# Altium schematic sheet BDAN_ACOND.SchDoc
size A4; SheetNumber: 3; SheetTotal: 5
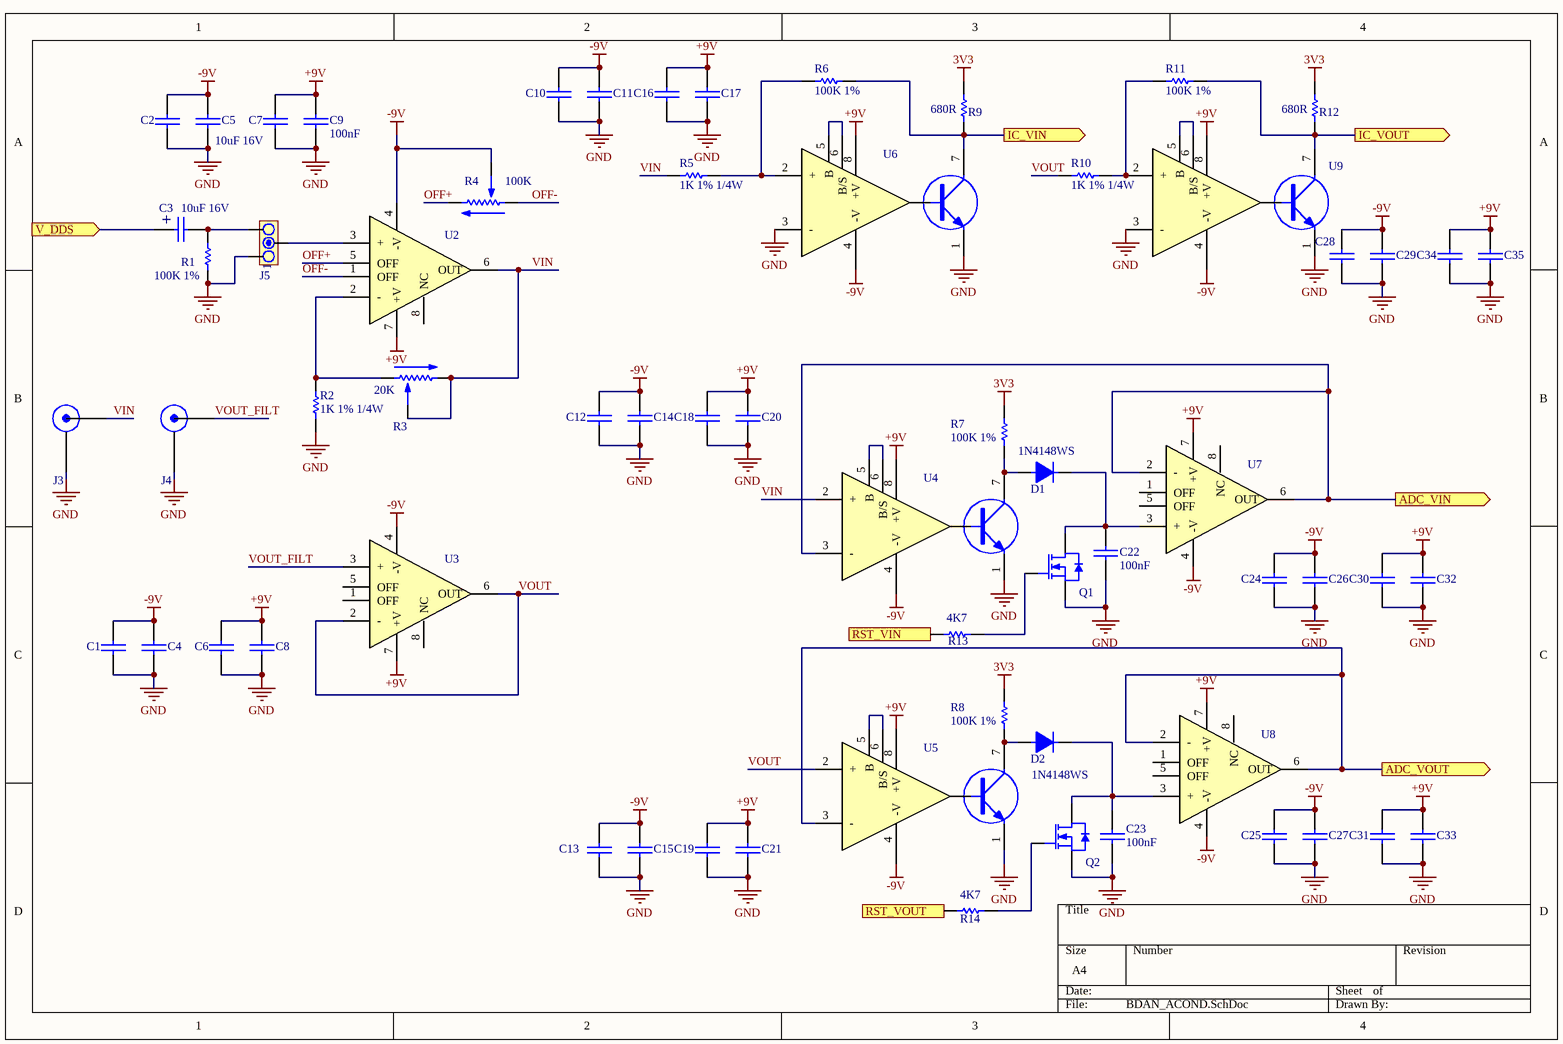
[diagram p0: BDAN_ACOND.SchDoc]

## Parts
C1  100nF  [0805]  (value not drawn)
C2  100nF  [0805]  (value not drawn)
C3  10uF 16V  [CAP318]
C4  10uF 16V  [0805]  (value not drawn)
C5  10uF 16V  [0805]  (value not drawn)
C6  10uF 16V  [0805]  (value not drawn)
C7  10uF 16V  [0805]
C8  100nF  [0805]  (value not drawn)
C9  100nF  [0805]
C10  100nF  [0805]  (value not drawn)
C11  10uF 16V  [0805]  (value not drawn)
C12  100nF  [0805]  (value not drawn)
C13  100nF  [0805]  (value not drawn)
C14  10uF 16V  [0805]  (value not drawn)
C15  10uF 16V  [0805]  (value not drawn)
C16  10uF 16V  [0805]  (value not drawn)
C17  100nF  [0805]  (value not drawn)
C18  10uF 16V  [0805]  (value not drawn)
C19  10uF 16V  [0805]  (value not drawn)
C20  100nF  [0805]  (value not drawn)
C21  100nF  [0805]  (value not drawn)
C22  100nF  [CAP508]
C23  100nF  [CAP508]
C24  100nF  [0805]  (value not drawn)
C25  100nF  [0805]  (value not drawn)
C26  10uF 16V  [0805]  (value not drawn)
C27  10uF 16V  [0805]  (value not drawn)
C28  100nF  [0805]  (value not drawn)
C29  10uF 16V  [0805]  (value not drawn)
C30  10uF 16V  [0805]  (value not drawn)
C31  10uF 16V  [0805]  (value not drawn)
C32  100nF  [0805]  (value not drawn)
C33  100nF  [0805]  (value not drawn)
C34  10uF 16V  [0805]  (value not drawn)
C35  100nF  [0805]  (value not drawn)
D1  1N4148WS  [SOD323F]
D2  1N4148WS  [SOD323F]
J3  BNC  [BNC]  (value not drawn)
J4  BNC  [BNC]  (value not drawn)
J5  JUMPER3  [JUMPER3]  (value not drawn)
Q1  2N7000  [TO92_DGS]  (value not drawn)
Q2  2N7000  [TO92_DGS]  (value not drawn)
R1  100K 1%  [0805]
R2  1K 1% 1/4W  [0805]
R3  20K  [3296W-TOP]
R4  100K  [3296W-TOP]
R5  1K 1% 1/4W  [0805]
R6  100K 1%  [0805]
R7  100K 1%  [0805]
R8  100K 1%  [0805]
R9  680R  [0805]
R10  1K 1% 1/4W  [0805]
R11  100K 1%  [0805]
R12  680R  [0805]
R13  4K7  [0805]
R14  4K7  [0805]
U2  OPA604APG4  [DIP8]  (value not drawn)
U3  OPA604APG4  [DIP8]  (value not drawn)
U4  LM311M  [DIP8]  (value not drawn)
U5  LM311M  [DIP8]  (value not drawn)
U6  LM311M  [DIP8]  (value not drawn)
U7  OPA604APG4  [DIP8]  (value not drawn)
U8  OPA604APG4  [DIP8]  (value not drawn)
U9  LM311M  [DIP8]  (value not drawn)

## Ports
ADC_VIN (out), ADC_VOUT (out), IC_VIN (out), IC_VOUT (out), RST_VIN (in), RST_VOUT (in), V_DDS (in)

## Nets
3V3: R7.2 R8.2 R9.2 R12.2
+9V: C6.1 C7.1 C8.1 C9.1 C16.1 C17.1 C18.1 C19.1 C20.1 C21.1 C30.1 C31.1 C32.1 C33.1 C34.1 C35.1 U2.7(+V) U3.7(+V) U4.8(+V) U5.8(+V) U6.8(+V) U7.7(+V) U8.7(+V) U9.8(+V)
-9V: C1.1 C2.1 C4.1 C5.1 C10.1 C11.1 C12.1 C13.1 C14.1 C15.1 C24.1 C25.1 C26.1 C27.1 C28.1 C29.1 R4.2(WIPER) U2.4(-V) U3.4(-V) U4.4(-V) U5.4(-V) U6.4(-V) U7.4(-V) U8.4(-V) U9.4(-V)
GND: C1.2 C2.2 C4.2 C5.2 C6.2 C7.2 C8.2 C9.2 C10.2 C11.2 C12.2 C13.2 C14.2 C15.2 C16.2 C17.2 C18.2 C19.2 C20.2 C21.2 C22.2 C23.2 C24.2 C25.2 C26.2 C27.2 C28.2 C29.2 C30.2 C31.2 C32.2 C33.2 C34.2 C35.2 J3.1 J4.1 J5.1 Q1.3(S) Q2.3(S) R1.1 R2.1 U4.1(EMIT_OUT) U5.1(EMIT_OUT) U6.1(EMIT_OUT) U6.3(-) U9.1(EMIT_OUT) U9.3(-)
ADC_VIN: U4.3(-) U7.2(-) U7.6(OUT) ; port ADC_VIN
ADC_VOUT: U5.3(-) U8.2(-) U8.6(OUT) ; port ADC_VOUT
IC_VIN: R6.1 R9.1 U6.7(COL_OUT) ; port IC_VIN
IC_VOUT: R11.1 R12.1 U9.7(COL_OUT) ; port IC_VOUT
OFF+: R4.3(CW) U2.5(OFF)
OFF-: R4.1(CCW) U2.1(OFF)
RST_VIN: R13.1 ; port RST_VIN
RST_VOUT: R14.1 ; port RST_VOUT
V_DDS: C3.1 ; port V_DDS
VIN: J3.2 R3.2(WIPER) R3.3(CW) R5.2 U2.6(OUT) U4.2(+)
VOUT: R10.2 U3.2(-) U3.6(OUT) U5.2(+)
VOUT_FILT: J4.2 U3.3(+)
NetC3_2: C3.2 J5.3 R1.2
NetC22_1: C22.1 D1.2 Q1.2(D) U7.3(+)
NetC23_1: C23.1 D2.2 Q2.2(D) U8.3(+)
NetD1_1: D1.1 R7.1 U4.7(COL_OUT)
NetD2_1: D2.1 R8.1 U5.7(COL_OUT)
NetJ5_2: J5.2 U2.3(+)
NetQ1_1: Q1.1(G) R13.2
NetQ2_1: Q2.1(G) R14.2
NetR2_2: R2.2 R3.1(CCW) U2.2(-)
NetR5_1: R5.1 R6.2 U6.2(+)
NetR10_1: R10.1 R11.2 U9.2(+)
NetU4_5: U4.5(B) U4.6(B/S)
NetU5_5: U5.5(B) U5.6(B/S)
NetU6_5: U6.5(B) U6.6(B/S)
NetU9_5: U9.5(B) U9.6(B/S)

Not connected (* = marked no-connect by the designer): U2 8(NC); U3 1(OFF) 5(OFF) 8(NC); U7 1(OFF) 5(OFF) 8(NC); U8 1(OFF) 5(OFF) 8(NC)

## Notes on the sheet
- (in symbol CAP_TAN_10uF_16V_CAP318) +

## Library data of the parts
C1 C2 C8-C10 C12 C13 C17 C20 C21 C24 C25 C28 C32 C33 C35 = CAP0805_100nF_X7R: CAP0805 100nF X7R; CREO: CP; Part Number: CAP0805_100nF_X7R; Value: 100nF
C3 = CAP_TAN_10uF_16V_CAP318: CAP TANT 10UF 10% 16V RADIAL; Manufacturer: KYOCERA AVX; Manufacturer Part Number: TAP106K016CRS; CREO: JP; Part Number: CAP_TAN_10uF_16V_CAP318; Value: 10uF 16V; Supplier 1: Digi-Key; Supplier Part Number 1: 478-TAP106K016CRSCT-ND; APROBO: -
C4-C7 C11 C14-C16 C18 C19 C26 C27 C29-C31 C34 = CAP0805_10uF_16V_X5R: CAP0805 10uF 16V X5R; Manufacturer: TDK Corporation; Manufacturer Part Number: C2012X5R1C106K085AC; CREO: AP; Part Number: CAP0805_10uF_16V_X5R; Value: 10uF 16V; Supplier 1: Digi-Key; Supplier Part Number 1: 445-7644-1-ND
C22 C23 = CAP_CER_100nF_250V_CAP508: CAP CER RAD 100NF 250V C0G 10%; CREO: JP; Part Number: CAP_CER_100nF_250V_CAP508; Value: 100nF; Supplier 1: Digi-Key; APROBO: -
D1 D2 = 1N4148_SOD323F: DIODE 75V 150MA SOD323F; CREO: EB; Part Number: 1N4148_SOD323F; Value: 1N4148WS; Supplier 1: Digi-Key; Supplier Part Number 1: 1N4148WSFSTR-ND
J3 J4 = BNC: CONN BNC RCPT STR 50 OHM PCB; Manufacturer: Amphenol RF; Manufacturer Part Number: 112404; Publico: JP; Part Number: BNC; Value: BNC; Supplier 1: Digi-Key; Supplier Part Number 1: ACX1051-ND
J5 = JUMPER3_TH: TIRA DE PINES 1x3 0.1" + JUMPER; Manufacturer: Harwin Inc.; Manufacturer Part Number: M20-9990345; Publico: EB; Part Number: JUMPER3_TH; Value: JUMPER3; Supplier 1: Digi-Key; Supplier Part Number 1: 952-2263-ND; Aprobo: -
Q1 Q2 = 2N7000_TO92: MOSFET N-CH 60V 200MA TO-92; Publico: EB; Part Number: 2N7000_TO92; Value: 2N7000; Aprobo: -
R1 R6-R8 R11 = RES0805_100K_1%: RES0805 100K 1%; Manufacturer: Stackpole Electronics Inc; Manufacturer Part Number: RMCF0805FG100K; Publico: EB; Part Number: RES0805_100K_1%; Value: 100K 1%; Supplier 1: Digi-Key; Supplier Part Number 1: RMCF0805FG100KCT-ND; Aprobo: -
R2 R5 R10 = RES0805_1K_1%: RES SMD 1K OHM 1% 1/4W 0805; Manufacturer: Stackpole Electronics Inc; Manufacturer Part Number: RNCP0805FTD1K00; Publico: JS; Part Number: RES0805_1K_1%; Value: 1K 1% 1/4W; Supplier 1: Digi-Key; Supplier Part Number 1: RNCP0805FTD1K00TR-ND; Aprobo: -
R3 = TRIMMER_3296W_20K: 3296 TRIMMER 20K OHM 0.5W PC PIN; Manufacturer: Bourns Inc.; Manufacturer Part Number: 3296W-1-203; Publico: JP; Part Number: TRIMMER_3296W_20K; Value: 20K; Supplier 1: Digi-Key; Supplier Part Number 1: 3296W-203-ND; Aprobo: -
R4 = TRIMMER_3296W_100K_MULTI: 3296 TRIMMER 100K OHM 0.5W PC PIN; Manufacturer: Bourns Inc.; Manufacturer Part Number: 3296W-1-104LF; Publico: JP; Part Number: TRIMMER_3296W_100K_MULTI; Value: 100K; Supplier 1: Digi-Key; Supplier Part Number 1: 3296W-104LF-ND; Aprobo: -
R9 R12 = RES0805_680R_1%: RES0805 680R 1%; Manufacturer: Stackpole Electronics Inc; Manufacturer Part Number: RMCF0805FT680R; Publico: JP; Part Number: RES0805_680R_1%; Value: 680R; Supplier 1: Digi-Key; Supplier Part Number 1: RMCF0805FT680RCT-ND; Aprobo: -
R13 R14 = RES0805_4K7_5%: RES0805 4K7 5%; Manufacturer: Stackpole Electronics Inc; Publico: EB; Part Number: RES0805_4K7_5%; Value: 4K7; Supplier 1: Digi-Key; Supplier Part Number 1: RMCF0805JT4K70TR-ND; Aprobo: -
U2 U3 U7 U8 = OPA604APG4: IC OPAMP GP 1 CIRCUIT 8DIP; Manufacturer: Texas Instruments; Publico: JP; Part Number: OPA604APG4; Value: OPA604APG4; Manufacturer Part Number: OPA604APG4; Supplier 1: Digi-Key; Supplier Part Number 1: OPA604APG4-ND; Aprobo: -
U4-U6 U9 = LM311N: IC VOLTAGE COMPARATOR 8-SOIC; Part Number: LM311N; Publico: EB; Value: LM311M; Supplier 1: Digi-Key; Supplier Part Number 1: LM311MNS/NOPB-ND; Aprobo: -